# Altium schematic sheet LoraSTM32_2.SchDoc
size 420 x 297 mm; Organization: Altium Limited; Address1: L3, 12a Rodborough Rd; Address2: Frenchs Forest; Address3: NSW; Address4: Australia 2086; Scale: 1:1; Разраб.: Иванов; Обозначение документа: АБВГ.123456.001 Э3; Пров.: Петров; Утв.: Сидоров; Наименование организации: ОАО "Ваша фирма"; Перв. применение: АБВГ.123456.000; Наименование изделия 1: Плата; Наименование изделия 2: Схема электрическая; Наименование изделия 3: принципиальная; Нач. отд.: Нач. отд.; Фамилия нач. отд.: Сидоров
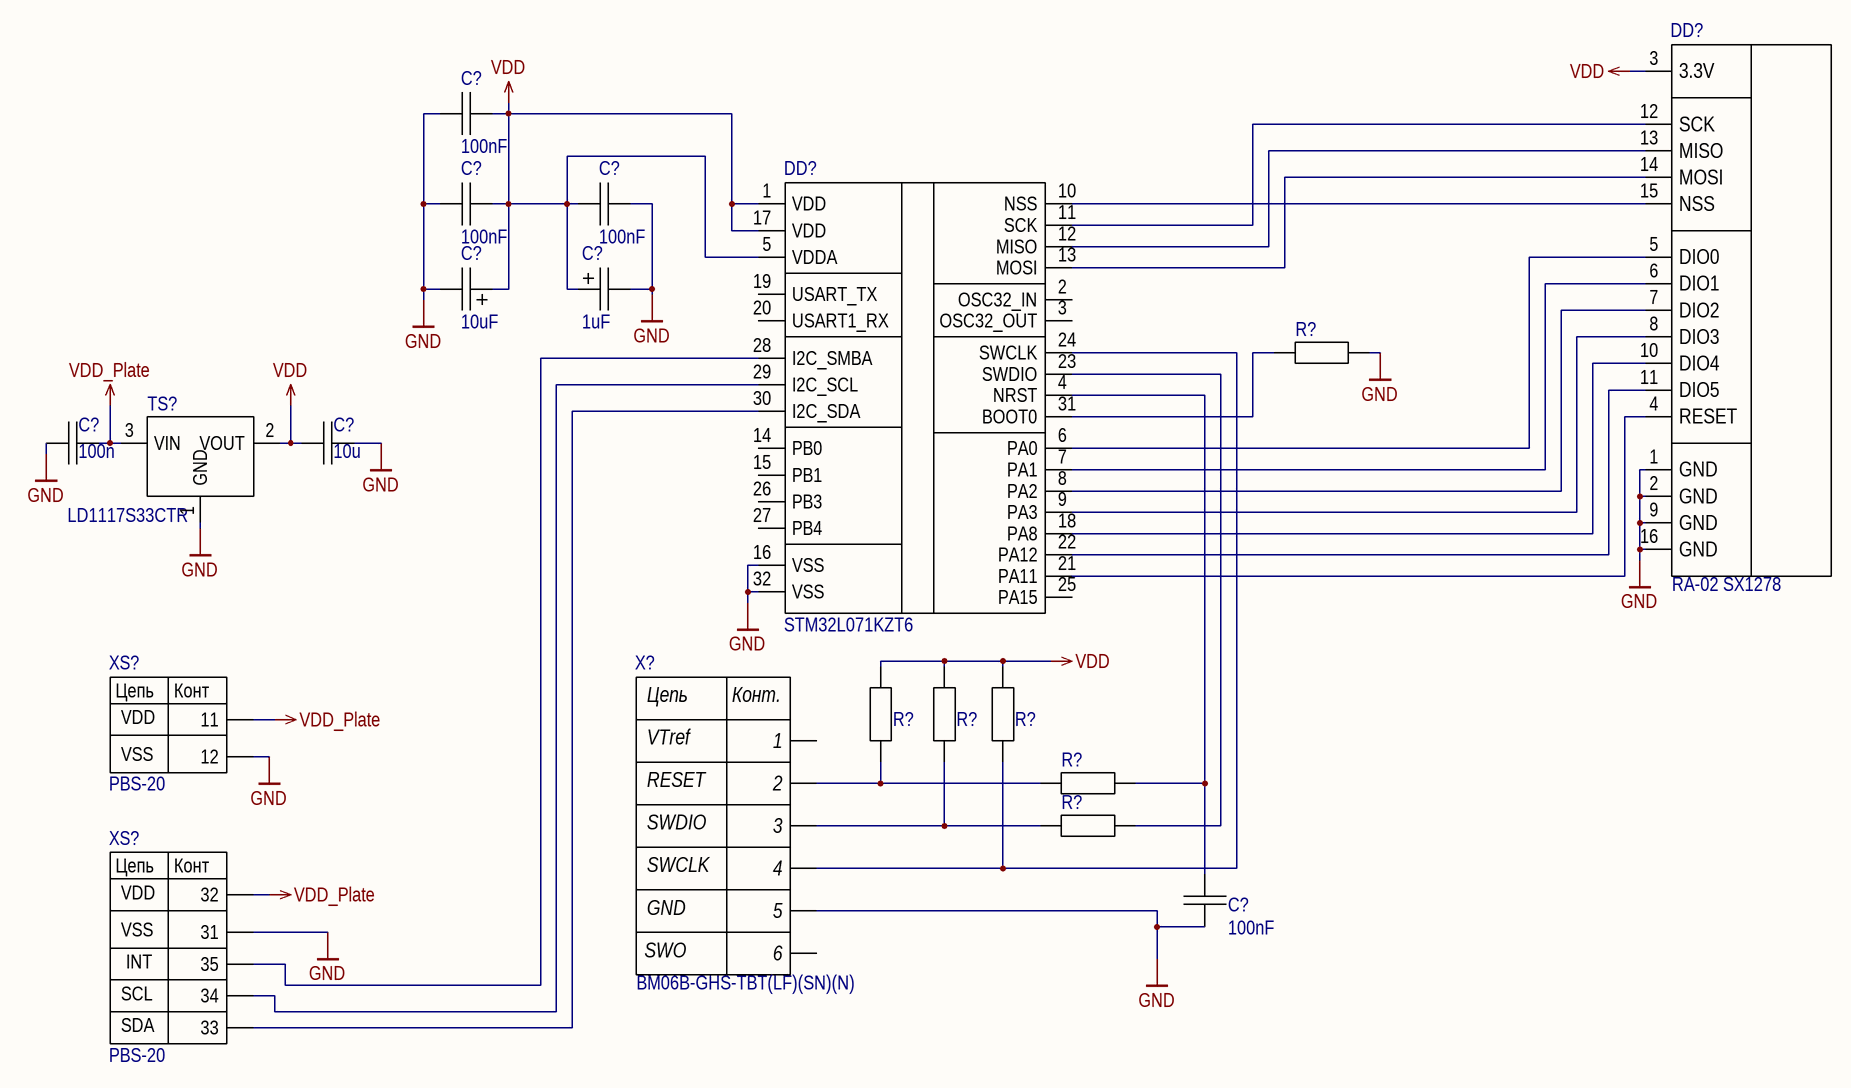
[diagram p0: LoraSTM32_2.SchDoc]

## Parts
(Parts that share a designator on the sheet are numbered #1, #2 ... from top to bottom, then left to right.)
C?#1  value 100nF  [CAPC0603X02N]  (hidden comment: CC0603)
C?#2  value 100nF  [CAPC0603X02N]  (hidden comment: CC0603)
C?#3  value 100nF  [CAPC0603X02N]  (hidden comment: CC0603)
C?#4  value 10uF  [CAPMP3216X16N-A]  (hidden comment: *)
C?#5  value 1uF  [CAPMP3216X16N-A]  (hidden comment: *)
C?#6  GRM21BR71C105KA01L: 100n  [Murata_GRM121_IPC_B]  (hidden comment: *)
C?#7  GRM21BR71C105KA01L: 10u  [Murata_GRM121_IPC_B]  (hidden comment: *)
C?#8  value 100nF  [CAPC0603X02N]  (hidden comment: CC0603)
DD?#1  RA-02 SX1278  [RA-02]
DD?#2  STM32L071KZT6  [*QFP80P900X900X160-32N]
R?#1  R1608  [RESC1608X05N]  (value not drawn)
R?#2  R1608  [RESC1608X05N]  (value not drawn)
R?#3  R1608  [RESC1608X05N]  (value not drawn)
R?#4  R1608  [RESC1608X05N]  (value not drawn)
R?#5  R1608  [RESC1608X05N]  (value not drawn)
R?#6  R1608  [RESC1608X05N]  (value not drawn)
TS?  LD1117S33CTR  [SOT-23-TT3_M]
X?  BM06B-GHS-TBT(LF)(SN)(N)  [BM06B-GH]
XS?#1  PBS-20  [PBS-20 - 13]
XS?#2  PBS-20  [PBS-20]

## Nets
GND: C?#1.1 C?#2.1 C?#3.2 C?#4.2 C?#5.2 C?#6.2 C?#7.1 C?#8.2 DD?#1.1(GND) DD?#1.2(GND) DD?#1.9(GND) DD?#1.16(GND) DD?#2.16(VSS) DD?#2.32(VSS) R?#1.1 TS?.1(GND) X?.5 XS?#1.12 XS?#2.10(31)
VDD: C?#1.2 C?#2.2 C?#3.1 C?#4.1 C?#5.1 C?#7.2 DD?#1.3(3.3V) DD?#2.1(VDD) DD?#2.5(VDDA) DD?#2.17(VDD) R?#2.1 R?#3.1 R?#4.1 TS?.2(VOUT)
VDD_Plate: C?#6.1 TS?.3(VIN) XS?#1.11 XS?#2.9(32)
NetC?#8_1: C?#8.1 DD?#2.4(NRST) R?#5.1
NetDD?#1_4: DD?#1.4(RESET) DD?#2.21(PA11)
NetDD?#1_5: DD?#1.5(DIO0) DD?#2.6(PA0)
NetDD?#1_6: DD?#1.6(DIO1) DD?#2.7(PA1)
NetDD?#1_7: DD?#1.7(DIO2) DD?#2.8(PA2)
NetDD?#1_8: DD?#1.8(DIO3) DD?#2.9(PA3)
NetDD?#1_10: DD?#1.10(DIO4) DD?#2.18(PA8)
NetDD?#1_11: DD?#1.11(DIO5) DD?#2.22(PA12)
NetDD?#1_12: DD?#1.12(SCK) DD?#2.11(SCK)
NetDD?#1_13: DD?#1.13(MISO) DD?#2.12(MISO)
NetDD?#1_14: DD?#1.14(MOSI) DD?#2.13(MOSI)
NetDD?#1_15: DD?#1.15(NSS) DD?#2.10(NSS)
NetDD?#2_23: DD?#2.23(SWDIO) R?#6.1
NetDD?#2_24: DD?#2.24(SWCLK) R?#4.2 X?.4
NetDD?#2_28: DD?#2.28(I2C_SMBA) XS?#2.6(35)
NetDD?#2_29: DD?#2.29(I2C_SCL) XS?#2.7(34)
NetDD?#2_30: DD?#2.30(I2C_SDA) XS?#2.8(33)
NetDD?#2_31: DD?#2.31(BOOT0) R?#1.2
NetR?#2_2: R?#2.2 R?#5.2 X?.2
NetR?#3_2: R?#3.2 R?#6.2 X?.3

Not connected (* = marked no-connect by the designer): DD?#2 2(OSC32_IN) 3(OSC32_OUT) 14(PB0) 15(PB1) 19(USART_TX) 20(USART1_RX) 25(PA15) 26(PB3) 27(PB4); X? 1 6

## Notes on the sheet
- Перв. примен.
- Справ. №
- Подп. и дата
- Инв. № дубл.
- Взам. инв. №
- Разраб.
- Изм.
- Лист
- № докум.
- Подп.
- Дата
- Лит.
- Масса
- Масштаб
- Пров.
- Т.контр.
- Листов
- Инв. № подл.
- Утв.
- Н.контр.
- Копировал
- Формат А3
- (in symbol PBS-20_1) Цепь; Конт; VDD; VSS
- (in symbol PBS_20_2) Цепь; Конт; VDD; VSS; INT; SCL; SDA
- (in symbol Разъем SWD) Цепь; Конт.; VTref; RESET; SWDIO; SWCLK; GND; SWO

## Library data of the parts
C?#1-C?#3 C?#8 = CC0603: Конденсатор 0.6х0.3 мм; Voltage: *; Type: *; PartNo: *; Supplier Part Number 1: *; Supplier 1: *; РКД Наименование: *
C?#4 C?#5 = CT3216-A: Tantalum Surface Mount Capacitor, Size A; Voltage: 6.3V; Type: *; PartNo: *; Supplier Part Number 1: *; Supplier 1: *
C?#6 C?#7 = CC1608: Конденсатор 1.6x0.8 мм; Tolerance: ±10%; ТКЕ: X7R; РКД Наименование: CC1608M - NP0 - 16 V - 10 nF ±10%; Voltage: *; Type: *; PartNo: *; Supplier Part Number 1: *; Supplier 1: *
DD?#1 = RA-02
R?#1 R?#5 R?#6 = R1608: Резистор 1.6x0.8 мм; Tolerance: ±1%; РКД Наименование: RC1608M - 22 Ohm ±1%; Value: 22; Type: *; PartNo: *; Supplier 1: *; Supplier Part Number 1: *
R?#2-R?#4 = R1608: Резистор 1.6x0.8 мм; Tolerance: ±1%; РКД Наименование: RC1608M - 22 Ohm ±1%; Value: 10k; Type: *; PartNo: *; Supplier 1: *; Supplier Part Number 1: *
TS? = MCP1700T-3302E/TT: Low Quiescent Current LDO, 3-Pin SOT-23, Extended Temperature, Tape and Reel; Code_IPC: SOT23-3; PackageVersion: revBB, Aug-2009; PackageReference: SOT-23-TT3; PackageDescription: 3-Lead Plastic Small Outline Transistor (TT) [SOT-23]; DatasheetVersion: revB, Feb-2007; PartNumber: MCP1700T-3302E/TT
X? = Разъем SWD: SWD отладка; Manufacturer: JST; Max Current Rating: 1A; Contact Resistance: 50mR; Number of Positions: 6; Max Voltage Rating (AC): 50V; Connector Type: Outer Shroud Contact; Pitch: 0.049inch; PartNo: BM06B-GHS-TBT(LF)(SN)(N); Supplier 1: Digi-Key; Supplier Part Number 1: 455-1582-1-ND; Manufacturer Part Number: BM06B-GHS-TBT(LF)(SN)(N); Stock 1: 44065; Pricing 1: 1=0.56, 10=0.524, 100=0.4019, 500=0.34948, 1000=0.28832 (USD); Mount: Surface Mount; Colour: Natural; Contact Plating: Copper,Tin; Contact Material: Bronze; Housing Colour: Beige; Housing Material: Polyamide; Min Operating Temperature: -25°C; Max Operating Temperature: 85°C; Number of Rows: 1; Fastening Type: Ramp; Packaging: Tape and Reel; Termination: Solder; Orientation: Straight; Length: 10.75mm; Depth: 4.25mm; Lead Free: Lead Free; ComponentLink1URL: http://www.jst-mfg.com/product/pdf/eng/eGH.pdf; ComponentLink1Description: http://www.jst-mfg.com/product/pdf/eng/eGH.pdf
XS?#1 = PBS-20_1: ComponentLink1Description: datasheet; ComponentLink1URL: https://static.chipdip.ru/lib/226/DOC000226931.pdf; ComponentLink2Description: buy; ComponentLink2URL: https://www.chipdip.ru/catalog-show/pin-connectors-and-sockets?x.698=ZGQ&gq=PBS
XS?#2 = PBS_20_2